# EAGLE design air (EAGLE 8.5.0)
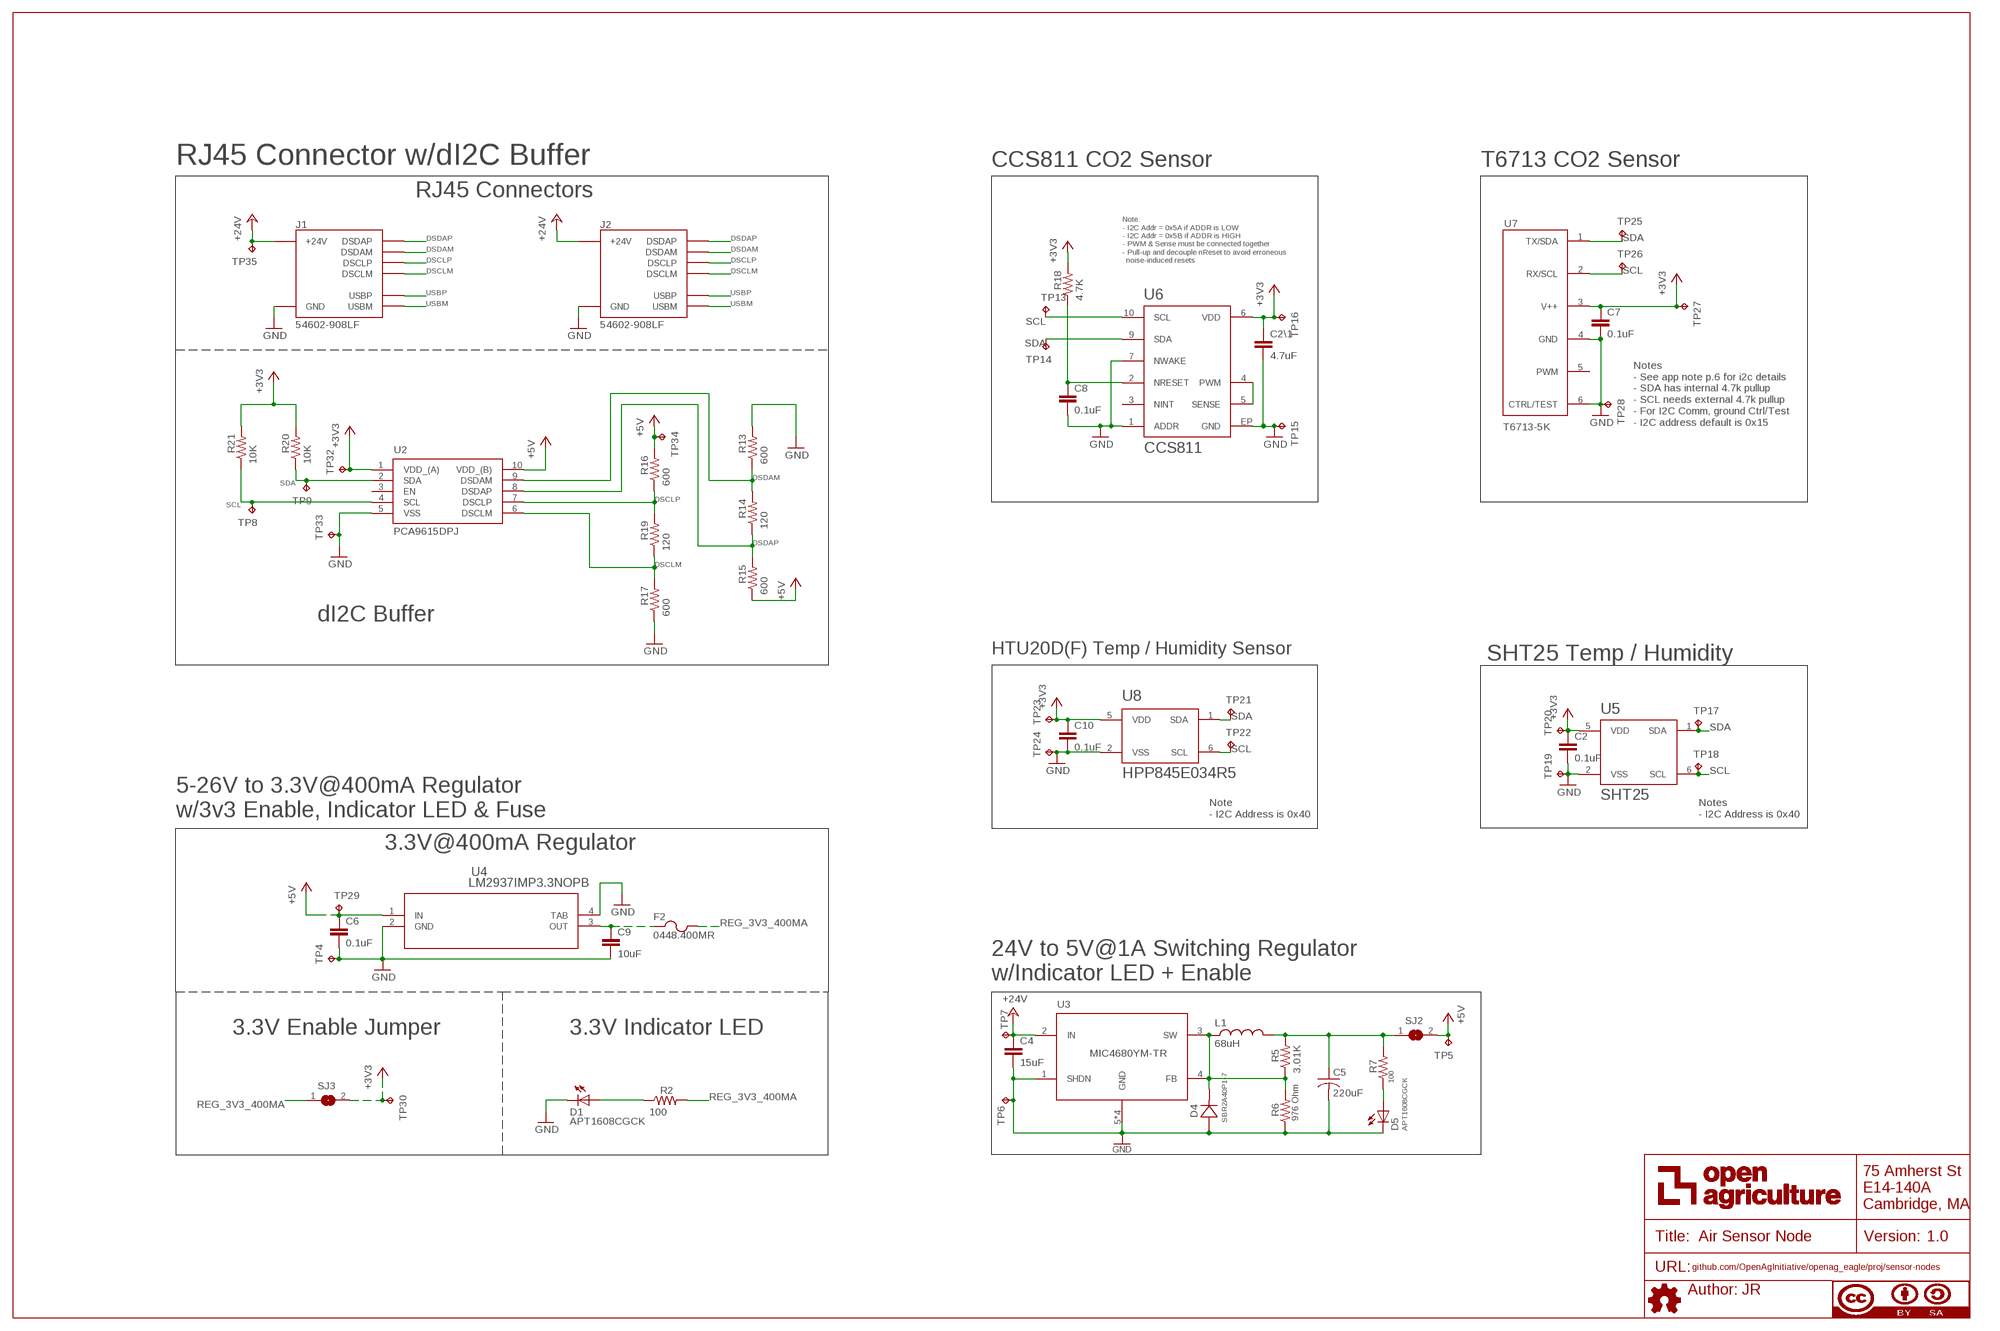
[diagram p0: schematic, sheet 1]

## Parts
C2  0.1uF  0.1UF-C0603C104K5RACTU  [C0603]
C2\1  4.7uF  4.7UF-CL21A475KBQNNNE  [C0805]
C4  15uF  15UF-C2012X5R1V156M125AC  [C0805]
C5  220uF  220UF-TPSY227K010R0100  [CT7343]
C6  0.1uF  0.1UF-C0603C104K5RACTU  [C0603]
C7  0.1uF  0.1UF-C0603C104K5RACTU  [C0603]
C8  0.1uF  0.1UF-C0603C104K5RACTU  [C0603]
C9  10uF  10UF-GMK212BBJ106KG-T  [C0805]
C10  0.1uF  0.1UF-C0603C104K5RACTU  [C0603]
D1  APT1608CGCK  [CHIPLED_0603]
D4  SBR2A40P1-7  [POWERDI123]
D5  APT1608CGCK  [CHIPLED_0603]
F2  0448.400MR  0438.375WR  [0603]
FRAME1  DOCFIELD  [DOCFIELD]
J1  54602-908LF  OPENAG-V1-RJ45PTH  [OPENAG-V1-RJ45]
J2  54602-908LF  OPENAG-V1-RJ45PTH  [OPENAG-V1-RJ45]
L1  68uH  68UH-UP2B-680-R  [UP2B]
R2  100  100OHM-RC0603JR-07100RL  [RC0603N]
R5  3.01K  3.01K-RC0603FR-073K01L  [RC0603N]
R6  976 Ohm  982OHM-RC0603FR-07976RL  [RC0603N]
R7  100  100OHM-RC0603JR-07100RL  [RC0603N]
R13  600  600OHM-RC0603FR-07604RL  [RC0603N]
R14  120  120OHM-RC0603FR-07120RL  [RC0603N]
R15  600  600OHM-RC0603FR-07604RL  [RC0603N]
R16  600  600OHM-RC0603FR-07604RL  [RC0603N]
R17  600  600OHM-RC0603FR-07604RL  [RC0603N]
R18  4.7K  4.7K-RC1206JR-074K7L  [R1206]
R19  120  120OHM-RC0603FR-07120RL  [RC0603N]
R20  10K  10K-ERJ-3EKF1002V  [RC0603N]
R21  10K  10K-ERJ-3EKF1002V  [RC0603N]
SJ2  SOLDERJUMPERREFLOW_NOPASTE  [SOLDERJUMPER_REFLOW_NOPASTE]
SJ3  SOLDERJUMPERREFLOW_NOPASTE  [SOLDERJUMPER_REFLOW_NOPASTE]
TP4  TPTP06R  [TP06R]
TP5  TPTP06R  [TP06R]
TP6  TPTP06R  [TP06R]
TP7  TPTP06R  [TP06R]
TP8  TPTP06R  [TP06R]
TP9  TPTP06R  [TP06R]
TP13  TPTP06R  [TP06R]
TP14  TPTP06R  [TP06R]
TP15  TPTP06R  [TP06R]
TP16  TPTP06R  [TP06R]
TP17  TPTP06R  [TP06R]
TP18  TPTP06R  [TP06R]
TP19  TPTP06R  [TP06R]
TP20  TPTP06R  [TP06R]
TP21  TPTP06R  [TP06R]
TP22  TPTP06R  [TP06R]
TP23  TPTP06R  [TP06R]
TP24  TPTP06R  [TP06R]
TP25  TPTP06R  [TP06R]
TP26  TPTP06R  [TP06R]
TP27  TPTP06R  [TP06R]
TP28  TPTP06R  [TP06R]
TP29  TPTP06R  [TP06R]
TP30  TPTP06R  [TP06R]
TP32  TPTP06R  [TP06R]
TP33  TPTP06R  [TP06R]
TP34  TPTP06R  [TP06R]
TP35  TPTP06R  [TP06R]
U2  PCA9615DPJ  [SOP50P490X110-10N]
U3  MIC4680YM-TR  [SOIC8]
U4  LM2937IMP3.3NOPB  LM2937IMP-3.3/NOPB  [MP04A]
U5  SHT25  [SHT2X]
U6  CCS811  [CCS811]
U7  T6713-5K  [T6713]
U8  HPP845E034R5  [HTU20D(F)]

## Nets
+3V3: C2.1 C2\1.1 C7.1 C10.1 R18.2 R20.2 R21.2 SJ3.2 TP16.TP TP20.TP TP23.TP TP27.TP TP30.TP TP32.TP U2.1(VDD_(A)) U5.5(VDD) U6.6(VDD) U7.3(V++) U8.5(VDD)
+5V: C6.1 R15.1 R16.2 SJ2.2 TP5.TP TP29.TP TP34.TP U2.10(VDD_(B)) U4.1(IN)
+24V: C4.1 J1.24V(6)(+24V) J2.24V(6)(+24V) TP7.TP TP35.TP U3.2(IN)
DSCLM: J1.DSCLM(5)(DSCLM) J2.DSCLM(5)(DSCLM) R17.2 R19.1 U2.6(DSCLM)
DSCLP: J1.DSCLP(4)(DSCLP) J2.DSCLP(4)(DSCLP) R16.1 R19.2 U2.7(DSCLP)
DSDAM: J1.DSDAM(2)(DSDAM) J2.DSDAM(2)(DSDAM) R13.1 R14.2 U2.9(DSDAM)
DSDAP: J1.DSDAP(1)(DSDAP) J2.DSDAP(1)(DSDAP) R14.1 R15.2 U2.8(DSDAP)
GND: C2.2 C2\1.2 C4.2 C5.-(2(-)) C6.2 C7.2 C8.2 C9.2 C10.2 D1.C D4.- D5.C J1.GND(3)(GND) J2.GND(3)(GND) R6.1 R13.2 R17.1 TP4.TP TP6.TP TP15.TP TP19.TP TP24.TP TP28.TP TP33.TP U2.5(VSS) U3.1(SHDN) U3.5(GND) U3.6(GND) U3.7(GND) U3.8(GND) U4.2(GND) U4.4(TAB) U5.2(VSS) U6.1(ADDR) U6.7(NWAKE) U6.EP(GND) U7.4(GND) U7.6(CTRL/TEST) U8.2(VSS)
N$4: D1.A R2.1
N$5: C9.1 F2.1 U4.3(OUT)
N$20: U6.4(PWM) U6.5(SENSE)
N$21: C8.1 R18.1 U6.2(NRESET)
N$31: D4.+ L1.1 R5.1 R6.2 U3.3(SW) U3.4(FB)
N$32: D5.A R7.1
N$33: C5.+(1(+)) L1.2 R5.2 R7.2 SJ2.1
REG_3V3_400MA: F2.2 R2.2 SJ3.1
SCL: R21.1 TP8.TP TP13.TP TP18.TP TP22.TP TP26.TP U2.4(SCL) U5.6(SCL) U6.10(SCL) U7.2(RX/SCL) U8.6(SCL)
SDA: R20.1 TP9.TP TP14.TP TP17.TP TP21.TP TP25.TP U2.2(SDA) U5.1(SDA) U6.9(SDA) U7.1(TX/SDA) U8.1(SDA)
USBM: J1.USBM(8)(USBM) J2.USBM(8)(USBM)
USBP: J1.USBP(7)(USBP) J2.USBP(7)(USBP)
Unconnected: U2.3(EN) U6.3(NINT) U7.5(PWM)

## Notes on the sheet
- RJ45 Connector w/dI2C Buffer | CCS811 CO2 Sensor | T6713 CO2 Sensor
- RJ45 Connectors
- Note:
  - I2C Addr = 0x5A if ADDR is LOW
  - I2C Addr = 0x5B if ADDR is HIGH
  - PWM & Sense must be connected together
  - Pull-up and decouple nReset to avoid erroneous
    noise-induced resets
- Notes
  - See app note p.6 for i2c details
  - SDA has internal 4.7k pullup
  - SCL needs external 4.7k pullup
  - For I2C Comm, ground Ctrl/Test
  - I2C address default is 0x15
- dI2C Buffer
- HTU20D(F) Temp / Humidity Sensor
- SHT25 Temp / Humidity
- 5-26V to 3.3V@400mA Regulator 
  w/3v3 Enable, Indicator LED & Fuse
- Note
  - I2C Address is 0x40
- Notes
  - I2C Address is 0x40
- 3.3V@400mA Regulator
- 24V to 5V@1A Switching Regulator
  w/Indicator LED + Enable
- 3.3V Enable Jumper | 3.3V Indicator LED

## Library data of the parts
C2 C6-C8 C10 = openag-capacitors:0.1UF-C0603C104K5RACTU: Kemet - C0603C104K5RACTU - CAP CER 0.1UF 50V X7R 0603 Description: 0.1µF ±10% 50V Ceramic Capacitor X7R 0603 (1608 Metric) Technical Specifications: Capacitance: 0.1µF Tolerance: ±10% Rated Voltage: 50V Temperature Coefficient: X7R Operating Temperature: -55°C ~ 125°C Package / Case: 0603 (1608 Metric) Datasheet(s): X7R Dielectric, 6.3-250 VDC <https://search.kemet.com/component-edge/download/datasheet/C0603C104K5RACTU.pdf> Vendor(s): Digikey: 399-5089-1-ND <https://www.digikey.com/product-detail/en/kemet/C0603C104K5RACTU/399-5089-1-ND/1465623>; POPULATE: YES; VERIFIED: NO
C2\1 = openag-capacitors:4.7UF-CL21A475KBQNNNE: Samsung - CL21A475KBQNNNE - CAP CER 4.7UF 50V X5R 0805 Description: 4.7µF ±10% 50V Ceramic Capacitor X5R 0805 (2012 Metric) Technical Specifications: Capacitance: 4.7uF Tolerance: ±10% Rated Voltage: 50V Temperature Coefficient: X5R Operating Temperature: -55°C ~ 85°C Package/Case: 0805 (2012 Metric) Datasheet(s): CL21A475KBQNNNE Characteristics <http://www.samsungsem.com/kr/front/downloadcms.do?path=/kr/support/product-search/mlcc/__icsFiles/afieldfile/2014/11/05&fileName=C_CL21A475KBQNNNE.pdf> Vendor(s): Digikey: 1276-1248-1-ND <https://www.digikey.com/product-detail/en/samsung-electro-mechanics/CL21A475KBQNNNE/1276-1248-1-ND/3889334>; POPULATE: YES; VERIFIED: NO
C4 = openag-capacitors:15UF-C2012X5R1V156M125AC: TDK Corporation - C2012X5R1V156M125AC - CAP CER 15UF 35V X5R 0805 Description: 15µF ±20% 35V Ceramic Capacitor X5R 0805 (2012 Metric) Technical Specifications: Capacitance: 15µF Tolerance: ±20% Voltage - Rated: 35V Temperature Coefficient: X5R Operating Temperature: -55°C ~ 85°C Features: Low ESL Applications: General Purpose Mounting Type: Surface Mount, MLCC Package / Case: 0805 (2012 Metric) Size / Dimension: 0.079" L x 0.049" W (2.00mm x 1.25mm) Thickness (Max): 0.057" (1.45mm) Datasheet(s): C Series, General Datasheet <https://product.tdk.com/info/en/catalog/datasheets/mlcc_commercial_general_en.pdf> MLCC Part Number Guide <https://product.tdk.com/en/products/common/pdf/mlcc_partnumber_description.pdf> C Series, Gen Appl & Mid-Voltage Spec <https://product.tdk.com/info/en/catalog/spec/mlccspec_commercial_general_midvoltage_en.pdf> Vendor(s): Digikey: 445-14423-1-ND <https://www.digikey.com/product-detail/en/tdk-corporation/C2012X5R1V156M125AC/445-14423-1-ND/3956089>
C5 = openag-capacitors:220UF-TPSY227K010R0100: AVX Corporation - TPSY227K010R0100 - CAP TANT 220UF 10V 10% 2917 Description: 220µF Molded Tantalum Capacitors 10V 2917 (7343 Metric) 100 mOhm Technical Specifications: Capacitance: 220µF Tolerance: ±10% Voltage - Rated: 10V Type: Molded ESR (Equivalent Series Resistance): 100 mOhm Operating Temperature: -55°C ~ 125°C Mounting Type: Surface Mount Package / Case: 2917 (7343 Metric) Size / Dimension: 0.287" L x 0.169" W (7.30mm x 4.30mm) Height - Seated (Max): 0.079" (2.00mm) Manufacturer Size Code: Y Features: General Purpose Datasheet(s): TPS Series, Low ESR <http://datasheets.avx.com/TPS.pdf> Vendor(s): Digikey: 478-5408-1-ND <https://www.digikey.com/scripts/DkSearch/dksus.dll?Detail&itemSeq=250948888&uq=636531796868737363>
C9 = openag-capacitors:10UF-GMK212BBJ106KG-T: Taiyo Yuden - GMK212BBJ106KG-T - CAP CER 10UF 35V X5R 0805 Description: 10µF ±10% 35V Ceramic Capacitor X5R 0805 (2012 Metric) Technical Specifications: Capacitance: 10µF Tolerance: ±10% Rated Voltage: 35V Temperature Coefficient: X5R Operating Temperature: -55°C ~ 85°C Package / Case: 0805 (2012 Metric) Datasheet(s): GMK212BBJ106KG-T Spec <http://ds.yuden.co.jp/TYCOMPAS/ut/detail.do?productNo=GMK212BBJ106KG-T&fileName=GMK212BBJ106KG-T_SS&mode=specSheetDownload> Vendor(s): Digikey: 587-4893-1-ND <https://www.digikey.com/product-detail/en/taiyo-yuden/GMK212BBJ106KG-T/587-4893-1-ND/6563736>; POPULATE: YES; VERIFIED: NO
D1 D5 = openag-diodes:APT1608CGCK: Kingbright - APT1608CGCK - LED GREEN CLEAR 0603 SMD Description: Green 570nm LED Indication - Discrete 2.1V 0603 (1608 Metric) Technical Specifications: Color: Green Lens Color: Colorless Lens Transparency: Clear Millicandela Rating: 50mcd Lens Style/Size: Rectangle with Flat Top, 1.20mm x 0.80mm Voltage - Forward (Vf) (Typ): 2.1V Current - Test: 20mA Viewing Angle: 120° Mounting Type: Surface Mount Wavelength - Dominant: 570nm Wavelength - Peak: 574nm Package / Case: 0603 (1608 Metric) Supplier Device Package: Chip LED Size / Dimension: 1.60mm L x 0.80mm W Height (Max): 0.75mm Datasheet(s): APT1608CGCK <http://www.kingbrightusa.com/images/catalog/SPEC/APT1608CGCK.pdf> Vendor(s): Digikey: 754-1116-1-ND <https://www.digikey.com/product-detail/en/kingbright/APT1608CGCK/754-1116-1-ND/1747833#>; POPULATE: YES; VERIFIED: NO
D4 = openag-diodes:SBR2A40P1-7: Diodes Incorporated - SBR2A40P1-7 - DIODE SBR 40V 2A POWERDI123 Description: Diode Super Barrier 40V 2A Surface Mount PowerDI™ 123 Technical Specifications: Diode Type: Super Barrier Voltage - DC Reverse (Vr) (Max): 40V Current - Average Rectified (Io): 2A Voltage - Forward (Vf) (Max) @ If: 500mV @ 2A Speed: Standard Recovery >500ns, > 200mA (Io) Current - Reverse Leakage @ Vr: 100µA @ 40V Mounting Type: Surface Mount Package / Case: POWERDI®123 Supplier Device Package: PowerDI™ 123 Operating Temperature - Junction: -65°C ~ 150°C Base Part Number: SBR2A40 Datasheet(s): SBR2A40P1 <https://www.diodes.com/assets/Datasheets/SBR2A40P1.pdf> Vendor(s): Digikey: SBR2A40P1DITR-ND <https://www.digikey.com/product-detail/en/diodes-incorporated/SBR2A40P1-7/SBR2A40P1DITR-ND/1681825>
F2 = openag-fuses:0438.375WR: Littelfuse Inc. - 0448.400MR - FUSE BOARD MNT 400MA 125VAC/VDC Description: FUSE BOARD MNT 400MA 125VAC/VDC Technical Specifications: Fuse Type: Board Mount (Cartridge Style Excluded) Current Rating: 400mA Voltage Rating - AC: 125V Voltage Rating - DC: 125V Response Time: Fast Package / Case: 2-SMD, Square End Block Mounting Type: Surface Mount Breaking Capacity @ Rated Voltage: 50A Melting I²t: 0.0416 Approvals: CSA, UL Operating Temperature: -55°C ~ 125°C Size / Dimension: 0.240" L x 0.106" W x 0.106" H (6.10mm x 2.69mm x 2.69mm) DC Cold Resistance: 0.4895 Ohms Datasheet(s): 448 Series Datasheet <http://www.littelfuse.com/~/media/electronics/datasheets/fuses/littelfuse_fuse_448_datasheet.pdf.pdf> Vendor(s): Digikey: F5573CT-ND <https://www.digikey.com/product-detail/en/littelfuse-inc/0448.400MR/F5573CT-ND/3306934>; POPULATE: YES; VERIFIED: YES
FRAME1 = openag-frames:DOCFIELD: DOCUMENT FIELD; AUTHOR: JR; TITLE: Air Sensor Node; URL: github.com/OpenAgInitiative/openag_eagle/proj/sensor-nodes; VER: 1.0
J1 J2 = openag_connector:OPENAG-V1-RJ45: Amphenol FCI - 54602-908LF - CONN MOD JACK 8P8C R/A UNSHLD Description: Jack Modular Connector 8p8c (RJ45, Ethernet) 90� Angle (Right) Unshielded Cat3 Technical Specifications: Connector Type: Jack Number of Positions/Contacts: 8p8c (RJ45, Ethernet) Number of Ports: 1 Number of Rows: 1 Mounting Type: Through Hole Orientation: 90� Angle (Right) Termination: Solder Shielding: Unshielded Ratings: Cat3 Features: Board Lock LED Color: Does Not Contain LED Tab Direction: Down Contact Material: Copper Alloy Contact Finish: Gold Contact Finish Thickness: 15�in (0.38�m) Housing Material: Polyester, Glass Filled Operating Temperature: -40�C ~ 70�C Datasheet(s): 54601-x04(zzz)WPLF Drawing <http://cdn.amphenol-icc.com/media/wysiwyg/files/drawing/c-bmj-0102.pdf> Vendor(s): Digikey: 609-1046-ND <https://www.digikey.com/product-detail/en/amphenol-fci/54602-908LF/609-1046-ND/1001360>; POPULATE: YES; VERIFIED: NO
L1 = openag-inductors:68UH-UP2B-680-R: Eaton - UP2B-680-R - FIXED IND 68UH 1.5A 178.7 MOHM Description: 68µH Unshielded Wirewound Inductor 1.5A 178.7 mOhm Max Nonstandard Technical Specifications: Type: Wirewound Material - Core: Ferrite Inductance: 68µH Tolerance: ±20% Current Rating: 1.5A Current - Saturation: 1.2A Shielding: Unshielded DC Resistance (DCR): 178.7 mOhm Max Operating Temperature: -40°C ~ 85°C Frequency - Test: 100kHz Mounting Type: Surface Mount Package / Case: Nonstandard Size / Dimension: 0.550" L x 0.410" W (13.97mm x 10.41mm) Height - Seated (Max): 0.236" (6.00mm) Datasheet(s): UNI-PAC (-R) <http://www.cooperindustries.com/content/dam/public/bussmann/Electronics/Resources/product-datasheets/BUS_Elx_PM_4308_UNI_PAC_Power_Inductors.pdf> Vendor(s): Digikey: 513-1083-1-ND <https://www.digikey.com/scripts/DkSearch/dksus.dll?Detail&itemSeq=250945518&uq=636531821133403587>
R2 R7 = openag-resistors:100OHM-RC0603JR-07100RL: Yageo - RC0603JR-07100RL - RES SMD 100 OHM 5% 1/10W 0603 Description: 100 Ohms ±5% 0.1W, 1/10W Chip Resistor 0603 (1608 Metric) Moisture Resistant Thick Film Technical Specifications: Resistance: 100 Ohms Tolerance: ±5% Power (Watts): 0.1W, 1/10W Composition: Thick Film Features: Moisture Resistant Temperature Coefficient: ±100ppm/°C Operating Temperature: -55°C ~ 155°C Package / Case: 0603 (1608 Metric) Supplier Device Package: 0603 Size / Dimension: 0.063" L x 0.032" W (1.60mm x 0.80mm) Height - Seated (Max): 0.022" (0.55mm) Number of Terminations: 2 Datasheet(s): Thick Film Chip Resistor Intro <http://www.yageo.com.tw/exep/pages/download/literatures/PYu-R_INT-thick_7.pdf> Chip Resistor Marking <http://www.yageo.com/exep/pages/download/literatures/PYu-R_Marking_2.pdf> RC Series, L Datasheet <http://www.yageo.com/documents/recent/PYu-RC_Group_51_RoHS_L_8.pdf> Vendor(s): Digikey: 311-100GRCT-ND <https://www.digikey.com/product-detail/en/yageo/RC0603JR-07100RL/311-100GRCT-ND/729644>; POPULATE: YES; VERIFIED: NO
R5 = openag-resistors:3.01K-RC0603FR-073K01L: Yageo - RC0603FR-073K01L - RES SMD 3.01K OHM 1% 1/10W 0603 Description: 3.01 kOhms ±1% 0.1W, 1/10W Chip Resistor 0603 (1608 Metric) Moisture Resistant Thick Film Technical Specifications: Resistance: 3.01 kOhms Tolerance: ±1% Power (Watts): 0.1W, 1/10W Composition: Thick Film Features: Moisture Resistant Temperature Coefficient: ±100ppm/°C Operating Temperature: -55°C ~ 155°C Package / Case: 0603 (1608 Metric) Supplier Device Package: 0603 Size / Dimension: 0.063" L x 0.032" W (1.60mm x 0.80mm) Height - Seated (Max): 0.022" (0.55mm) Number of Terminations: 2 Datasheet(s): Chip Resistor Marking <http://www.yageo.com/exep/pages/download/literatures/PYu-R_Marking_2.pdf> RC Series, L Datasheet <http://www.yageo.com/documents/recent/PYu-RC_Group_51_RoHS_L_8.pdf> Vendor(s): Digikey: 311-3.01KHRCT-ND <https://www.digikey.com/scripts/DkSearch/dksus.dll?Detail&itemSeq=250949714&uq=636531832410541188>
R6 = openag-resistors:982OHM-RC0603FR-07976RL: Yageo - RC0603FR-07976RL - RES SMD 976 OHM 1% 1/10W 0603 Description: 976 Ohms ±1% 0.1W, 1/10W Chip Resistor 0603 (1608 Metric) Moisture Resistant Thick Film Technical Specifications: Resistance: 976 Ohms Tolerance: ±1% Power (Watts): 0.1W, 1/10W Composition: Thick Film Features: Moisture Resistant Temperature Coefficient: ±100ppm/°C Operating Temperature: -55°C ~ 155°C Package / Case: 0603 (1608 Metric) Supplier Device Package: 0603 Size / Dimension: 0.063" L x 0.032" W (1.60mm x 0.80mm) Height - Seated (Max): 0.022" (0.55mm) Number of Terminations: 2 Datasheet(s): Chip Resistor Marking <http://www.yageo.com/exep/pages/download/literatures/PYu-R_Marking_2.pdf> RC Series, L Datasheet <http://www.yageo.com/documents/recent/PYu-RC_Group_51_RoHS_L_8.pdf> Vendor(s): Digikey: 311-976HRCT-ND <https://www.digikey.com/scripts/DkSearch/dksus.dll?Detail&itemSeq=250949870&uq=636531835229553061>
R13 R15-R17 = openag-resistors:600OHM-RC0603FR-07604RL: Yageo - RC0603FR-07604RL - RES SMD 604 OHM 1% 1/10W 0603 Description: 604 Ohms ±1% 0.1W, 1/10W Chip Resistor 0603 (1608 Metric) Moisture Resistant Thick Film Technical Specifications: Resistance: 604 Ohms Tolerance: ±1% Power (Watts): 0.1W, 1/10W Composition: Thick Film Features: Moisture Resistant Temperature Coefficient: ±100ppm/°C Operating Temperature: -55°C ~ 155°C Package / Case: 0603 (1608 Metric) Supplier Device Package: 0603 Size / Dimension: 0.063" L x 0.032" W (1.60mm x 0.80mm) Height - Seated (Max): 0.022" (0.55mm) Number of Terminations: 2 Datasheet(s): RC Series, L Datasheet <http://www.yageo.com/documents/recent/PYu-RC_Group_51_RoHS_L_8.pdf> Chip Resistor Marking <http://www.yageo.com/exep/pages/download/literatures/PYu-R_Marking_2.pdf> Vendor(s): Digikey: 311-604HRCT-ND <https://www.digikey.com/product-detail/en/yageo/RC0603FR-07604RL/311-604HRCT-ND/730276>
R14 R19 = openag-resistors:120OHM-RC0603FR-07120RL: Yageo - RC0603FR-07120RL - RES SMD 120 OHM 1% 1/10W 0603 Description: 120 Ohms ±1% 0.1W, 1/10W Chip Resistor 0603 (1608 Metric) Moisture Resistant Thick Film Technical Specifications: Resistance: 120 Ohms Tolerance: ±1% Power (Watts): 0.1W, 1/10W Composition: Thick Film Features: Moisture Resistant Temperature Coefficient: ±100ppm/°C Operating Temperature: -55°C ~ 155°C Package / Case: 0603 (1608 Metric) Supplier Device Package: 0603 Size / Dimension: 0.063" L x 0.032" W (1.60mm x 0.80mm) Height - Seated (Max): 0.022" (0.55mm) Number of Terminations: 2 Datasheet(s): RC Series, L Datasheet <http://www.yageo.com/documents/recent/PYu-RC_Group_51_RoHS_L_8.pdf> Chip Resistor Marking <http://www.yageo.com/exep/pages/download/literatures/PYu-R_Marking_2.pdf> Vendor(s): Digikey: 311-120HRCT-ND <https://www.digikey.com/product-detail/en/yageo/RC0603FR-07120RL/311-120HRCT-ND/729867>
R18 = openag-resistors:4.7K-RC1206JR-074K7L: Yageo - RC1206JR-074K7L - RES SMD 4.7K OHM 5% 1/4W 1206 Description: 4.7 kOhms ±5% 0.25W, 1/4W Chip Resistor 1206 (3216 Metric) Moisture Resistant Thick Film Technical Specifications: Resistance: 4.7 kOhms Tolerance: ±5% Power (Watts): 0.25W, 1/4W Composition: Thick Film Features: Moisture Resistant Temperature Coefficient: ±100ppm/°C Operating Temperature: -55°C ~ 155°C Package / Case: 1206 (3216 Metric) Supplier Device Package: 1206 Size / Dimension: 0.122" L x 0.063" W (3.10mm x 1.60mm) Height - Seated (Max): 0.026" (0.65mm) Number of Terminations: 2 Datasheet(s): Thick Film Chip Resistor Intro <http://www.yageo.com.tw/exep/pages/download/literatures/PYu-R_INT-thick_7.pdf> Chip Resistor Marking <http://www.yageo.com/exep/pages/download/literatures/PYu-R_Marking_2.pdf> RC Series, L Datasheet <http://www.yageo.com/documents/recent/PYu-RC_Group_51_RoHS_L_8.pdf> Vendor(s): Digikey: 311-4.7KERCT-ND <https://www.digikey.com/product-detail/en/yageo/RC1206JR-074K7L/311-4.7KERCT-ND/732242>; POPULATE: YES; VERIFIED: NO
R20 R21 = openag-resistors:10K-ERJ-3EKF1002V: Panasonic - ERJ-3EKF1002V - RES SMD 10K OHM 1% 1/10W 0603 Description: 10 kOhms ±1% 0.1W, 1/10W Chip Resistor 0603 (1608 Metric) Automotive AEC-Q200 Thick Film Technical Specifications: Resistance: 10kOhms Tolerance: ±1% Power: 0.1W, 1/10W Operating Temperature: -55°C ~ 155°C Package/Case: 0603 (1608 Metric) Datasheet(s): ERJ-3EKF1002V View All Specifications <https://industrial.panasonic.com/ww/products/resistors/chip-resistors/general-purpose-chip-resistors/precision-thick-film-chip-resistors/ERJ3EKF1002V> Vendor(s): Digikey: P10.0KHCT-ND <https://www.digikey.com/product-detail/en/panasonic-electronic-components/ERJ-3EKF1002V/P10.0KHCT-ND/198102>; POPULATE: YES; VERIFIED: NO
SJ2 SJ3 = openag-connectors:SOLDERJUMPER: SMD Solder JUMPER Solder the two pads together to create a connection, or remove the solder to break it. REFLOW - Use this footprint for solder paste and reflow ovens. WAVE - Use this footprint for hand-soldering (larger pads). CLOSED - Has a trace between the two pads to ensure it is closed by default. The trace needs to be cut to disable the jumper, and can be closed again by creating a solder bridge between the two pads.; POPULATE: YES; VERIFIED: NO
TP4-TP9 TP13-TP30 TP32-TP35 = openag-testpads:TP: Test pad
U2 = openag-buffers:PCA9615DPJ: NXP USA Inc. - PCA9615DPJ - IC REDRIVER I2C 2CH 10TSSOP Description: Buffer, ReDriver 2 Channel 400kHz 10-TSSOP Technical Specifications: Type: Buffer, ReDriver Applications: I²C Input: 2-Wire Bus Output: 2-Wire Bus Data Rate (Max): 400kHz Number of Channels: 2 Capacitance - Input: 7pF Voltage - Supply: 2.3 V ~ 5.5 V Current - Supply: 16µA Operating Temperature: -40°C ~ 85°C Package / Case: 10-TFSOP, 10-MSOP (0.118", 3.00mm Width) Supplier Device Package: 10-TSSOP Base Part Number: PCA9615 Datasheet(s): PCA9615DP <http://www.nxp.com/documents/data_sheet/PCA9615.pdf> Vendor(s): Digikey: 568-11484-1-ND <https://www.digikey.com/product-detail/en/nxp-usa-inc/PCA9615DPJ/568-11484-1-ND/4864508>
U3 = openag-regulators:MIC4680YM-TR: Microchip Technology - MIC4680YM-TR - IC REG BUCK BOOST ADJ 1.3A 8SOIC Description: Buck, Buck-Boost Switching Regulator IC Positive Adjustable 1.23V 1 Output 1.3A 8-SOIC (0.154", 3.90mm Width) Technical Specifications: Function: Step-Down, Step-Up/Step-Down Output Configuration: Positive Topology: Buck, Buck-Boost Output Type: Adjustable Number of Outputs: 1 Voltage - Input (Min): 4V Voltage - Input (Max): 34V Voltage - Output (Min/Fixed): 1.23V Voltage - Output (Max): 32.98V Current - Output: 1.3A Frequency - Switching: 200kHz Synchronous Rectifier: No Operating Temperature: -40°C ~ 125°C (TJ) Mounting Type: Surface Mount Package / Case: 8-SOIC (0.154", 3.90mm Width) Supplier Device Package: 8-SOIC Base Part Number: MIC4680 Datasheet(s): MIC4680 <http://www.microchip.com/mymicrochip/filehandler.aspx?ddocname=en579250> Vendor(s): Digikey: 576-1222-1-ND <https://www.digikey.com/scripts/DkSearch/dksus.dll?Detail&itemSeq=250950999&uq=636531791983475304>
U4 = openag-regulators:LM2937IMP-3.3/NOPB: Texas Instruments - LM2937IMP-3.3/NOPB - IC REG LIN 3.3V 400MA SOT223-4 Description: Linear Voltage Regulator IC Positive Fixed 1 Output 3.3V 400mA SOT-223-4 Technical Specifications: Output Configuration: Positive Output Type: Fixed Number of Regulators: 1 Voltage - Input (Max): 26V Voltage - Output (Min/Fixed): 3.3V Voltage Dropout (Max): 1V @ 50mA Current - Output: 400mA Current - Quiescent (Iq): 2mA Current - Supply (Max): 1.25A Protection Features: Over Temperature, Reverse Polarity, Short Circuit Operating Temperature: -40°C ~ 85°C Mounting Type: Surface Mount Package / Case: TO-261-4, TO-261AA Supplier Device Package: SOT-223-4 Base Part Number: LM2937 Datasheet(s): LM2937-2.5, LM2937-3.3 Datasheet <http://www.ti.com/lit/ds/symlink/lm2937-2.5.pdf> Vendor(s): Digikey: LM2937IMP-3.3/NOPBCT-ND <https://www.digikey.com/product-detail/en/texas-instruments/LM2937IMP-3.3-NOPB/LM2937IMP-3.3-NOPBCT-ND/270742#>; POPULATE: YES; VERIFIED: NO
U5 = openag-sensors:SHT25: Sensirion AG - SHT25 - SENSOR HUMI/TEMP 3V I2C 1.8% SMD Description: Humidity Temperature Sensor 0 ~ 100% RH I²C ±1.8% RH 8s Surface Mount Technical Specifications: Sensor Type: Humidity, Temperature Humidity Range: 0 ~ 100% RH Output Type: I²C Output: 12b Accuracy: ±1.8% RH Response Time: 8s Voltage - Supply: 2.1 V ~ 3.6 V Mounting Type: Surface Mount Operating Temperature: -40°C ~ 125°C Datasheet(s): SHTxx Testing Guide <https://www.sensirion.com/fileadmin/user_upload/customers/sensirion/Dokumente/2_Humidity_Sensors/Sensirion_Humidity_Sensors_Testing_Guide_V1.2.pdf> SHTxx Handling Instructions <https://www.sensirion.com/fileadmin/user_upload/customers/sensirion/Dokumente/2_Humidity_Sensors/Sensirion_Humidity_Sensors_Handling_Instructions_V4.pdf> Sensor Specification Statement <https://www.sensirion.com/fileadmin/user_upload/customers/sensirion/Dokumente/2_Humidity_Sensors/Sensirion_Humidity_Sensors_Specification_Statement_V1.pdf> SHTxx, STSxx Assembly SMD Pkgs <https://www.sensirion.com/fileadmin/user_upload/customers/sensirion/Dokumente/2_Humidity_Sensors/Sensirion_Humidity_Sensors_Handling_of_SMD_Packages_V1.pdf> SHT25 Datasheet <https://www.sensirion.com/fileadmin/user_upload/customers/sensirion/Dokumente/2_Humidity_Sensors/Sensirion_Humidity_Sensors_SHT25_Datasheet_V3.pdf> Vendor(s): Digikey: 1649-1008-1-ND <https://www.digikey.com/product-detail/en/sensirion-ag/SHT25/1649-1008-1-ND/5872290>; POPULATE: YES; VERIFIED: NO
U6 = openag-sensors:CCS811: ams - CCS811 - LOW POWER DIGITAL SENSOR FOR IND Description: Air Quality Sensor I²C Technical Specifications: Type: Air Quality Output: I²C Operating Temperature: -5°C ~ 50°C Voltage - Supply: 1.8 V ~ 3.6 V Current - Supply: 26mA Datasheet(s): CCS811 Datasheet <http://ams.com/eng/content/download/951091/2269479/471718> CCS811 Factsheet <http://ams.com/eng/content/view/download/490399> Vendor(s): Digikey: CCS811CT-ND <https://www.digikey.com/product-detail/en/ams/CCS811/CCS811CT-ND/6569300>; POPULATE: YES; VERIFIED: NO
U7 = openag-sensors:T6713-5K: Amphenol Advanced Sensors - T6713-5K - CO2 MODULE 5000PPM DIFFUSION Description: CO2 Sensor I²C Technical Specifications: Type: CO2 Accuracy: ±2% Output: I²C Operating Temperature: 14 ~ 140°F (-10 ~ 60°C) Voltage - Supply: 4.5 V ~ 5.5 V Current - Supply: 200mA Datasheet(s): T6713 Series Datasheet <http://www.amphenol-sensors.com/en/component/edocman/297-telaire-t6713-series-datasheet/download?Itemid=591> Telaire CO2 Module Selection Guide <http://www.amphenol-sensors.com/en/component/edocman/488-telaire-co2-module-selection-guide-single-or-dual-channel/download?Itemid=591> T67xx Appl Note <http://www.amphenol-sensors.com/en/component/edocman/332-telaire-6700-series-application-note/download?Itemid=591> Vendor(s): Digikey: 235-1374-ND <https://www.digikey.com/products/en?keywords=235-1374>; POPULATE: YES; VERIFIED: NO
U8 = openag-sensors:HPP845E034R5: TE Connectivity Measurement Specialties - HPP845E034R5 - SENSOR HUMID/TEMP 3V I2C 3% SMD Description: Humidity Temperature Sensor 0 ~ 100% RH I²C ±5% RH 5s Surface Mount Technical Specifications: Sensor Type: Humidity, Temperature Humidity Range: 0 ~ 100% RH Output Type: I²C Output: 12b Accuracy: ±5% RH Response Time: 5s Voltage - Supply: 1.5 V ~ 3.6 V Mounting Type: Surface Mount Operating Temperature: -40°C ~ 125°C Datasheet(s): HTU20D(F) Series (HPP845E034Rx) Datasheet <http://www.te.com/commerce/DocumentDelivery/DDEController?Action=srchrtrv&DocNm=HPC202_5&DocType=Data+Sheet&DocLang=English> Vendor(s): Digikey: 223-1592-1-ND <https://www.digikey.com/product-detail/en/te-connectivity-measurement-specialties/HPP845E034R5/223-1592-1-ND/5416096>; POPULATE: YES; VERIFIED: NO

## Board
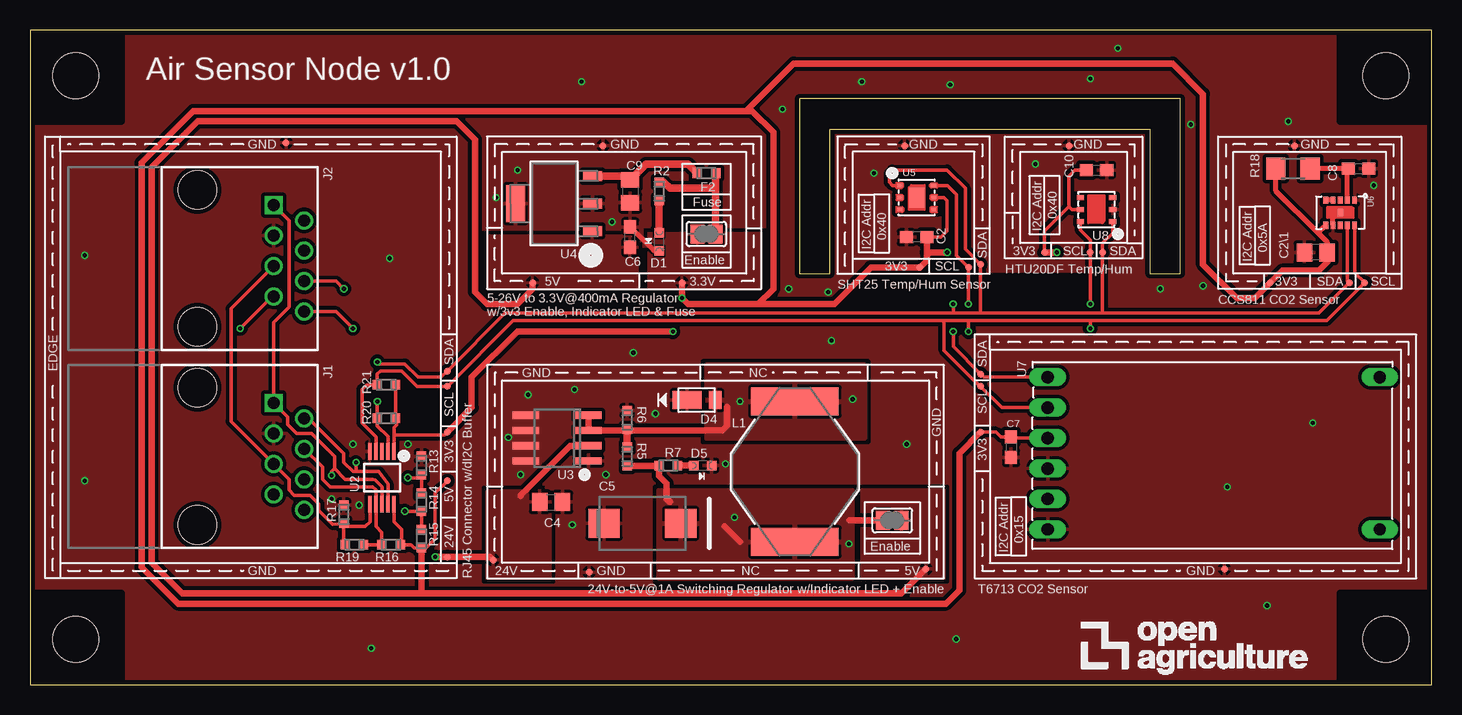
[diagram p1: board, top side]
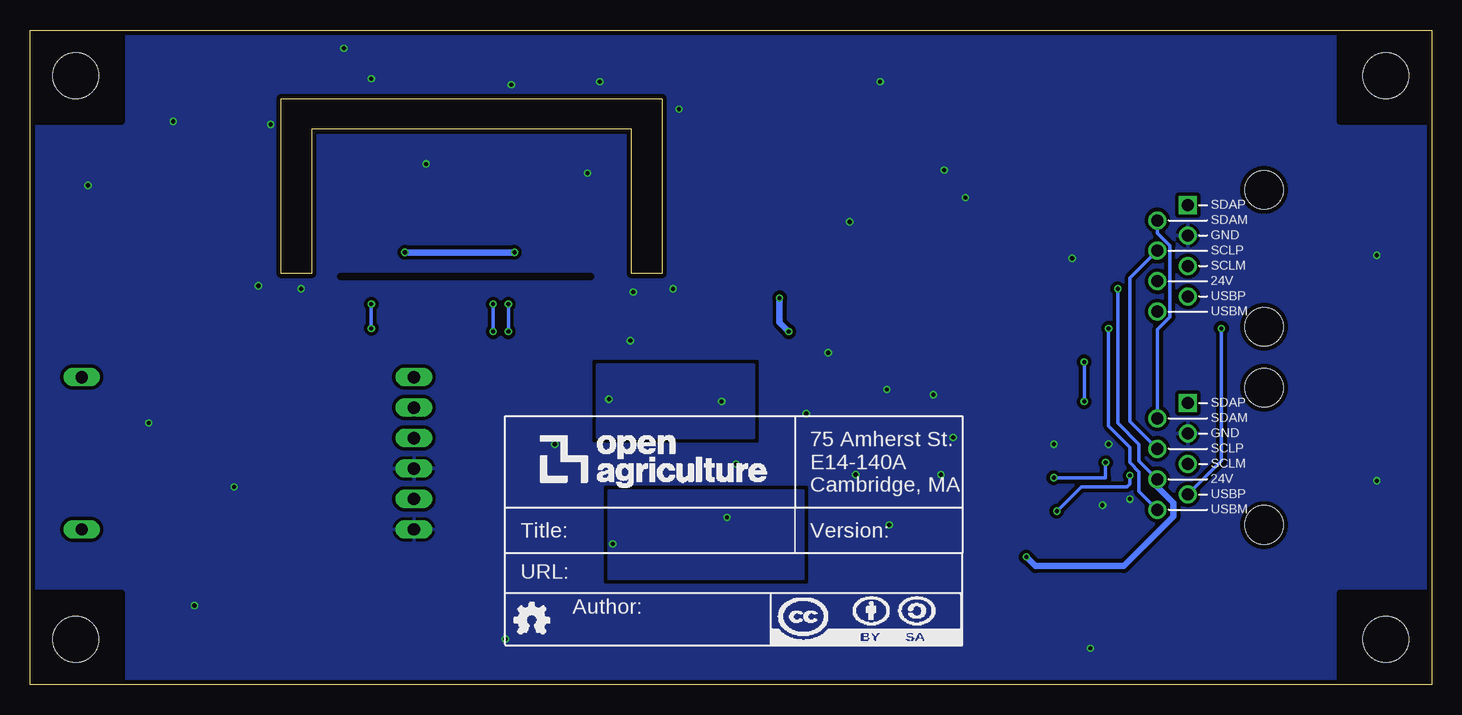
[diagram p2: board, bottom side, seen from below]

Size 116.84 x 54.61 mm. Coordinates in mm from the lower left corner, seen from the top.
Outline: 66.67,34.29 66.67,46.35 93.34,46.35 93.34,34.29 95.89,34.29 95.89,48.9 64.14,48.9 64.14,34.29 66.67,34.29
Outline: 0,0 116.84,0 116.84,54.61 0,54.61 0,0
Copper layers (1*16): Top 0.035559375mm / dielectric 1.6mm / Bottom 0.035559375mm
Design rules "oshpark-2layer-mask": minimum track width 6mil, minimum drill 10mil, track to track 6mil, track to pad 6mil, pad to pad 6mil, via to via 6mil, smd to smd 6mil, copper to edge 15mil, drill to drill 6mil, minimum pad ring 5mil, minimum via ring 5mil, stop-mask expansion 2.5mil, vias tented up to drill 20mil, thermal gap 10mil
tRestrict: 2 lines
bRestrict: 1 lines

### Footprints (pad centres in the part's own frame; a part is rotated, then mirrored left to right if it is on the bottom)
C0603 = smd 1.1 x 1: 1 -0.85,0; 2 0.85,0
C0805 = smd 1.3 x 1.5: 1 -0.95,0; 2 0.95,0
CT7343 = smd 2.6 x 2.4: + -3.2,0; - 3.2,0
CHIPLED_0603 = smd 0.8 x 0.8: A 0,-0.75; C 0,0.75
POWERDI123 = smd 1.05 x 1.5: + -1.3,0 | smd 2.4 x 1.5: - 1.05,0
0603 = smd 0.756 x 0.8: 1 -0.778,0; 2 0.778,0
OPENAG-V1-RJ45 = drill 1: 24V(6) 1.905,8.89; DSCLM(5) 0.635,6.35; DSCLP(4) -0.635,8.89; DSDAM(2) -3.175,8.89; GND(3) -1.905,6.35; USBM(8) 4.445,8.89; USBP(7) 3.175,6.35 | drill 1 square: DSDAP(1) -4.445,6.35 | hole 3.2: -5.715,0; 5.715,0
UP2B = smd 2.311 x 7.29: 1 -5.855,0; 2 5.855,0
RC0603N = smd 0.756 x 0.8: 1 -0.778,0; 2 0.778,0
R1206 = smd 1.6 x 1.803: 1 -1.422,0; 2 1.422,0
SOLDERJUMPER_REFLOW_NOPASTE = smd 1.168 x 1.6: 1 -0.762,0; 2 0.762,0
TP06R = smd 0.6 x 0.6: TP 0,0
SOP50P490X110-10N = smd 1.4 x 0.3: 1 -2.2,1; 2 -2.2,0.5; 3 -2.2,0; 4 -2.2,-0.5; 5 -2.2,-1; 6 2.2,-1; 7 2.2,-0.5; 8 2.2,0; 9 2.2,0.5; 10 2.2,1
SOIC8 = smd 0.6 x 2.2: 1 -1.905,-2.6; 2 -0.635,-2.6; 3 0.635,-2.6; 4 1.905,-2.6; 5 1.905,2.6; 6 0.635,2.6; 7 -0.635,2.6; 8 -1.905,2.6
MP04A = smd 1.6 x 0.838: 1 -3.2,2.3; 2 -3.2,0; 3 -3.2,-2.3 | smd 1.6 x 3.099: 4 3.2,0
SHT2X = smd 0.3 x 0.4: 1 -1,-1.4; 2 0,-1.4; 3 1,-1.4; 4 1,1.4; 5 0,1.4; 6 -1,1.4 | smd 1.651 x 1.27: 7 0,0
CCS811 = smd 0.6 x 0.4: 1 -1.05,1.2; 2 -1.05,0.6; 3 -1.05,0; 4 -1.05,-0.6; 5 -1.05,-1.2; 6 1.05,-1.2; 7 1.05,-0.6; 8 1.05,0; 9 1.05,0.6; 10 1.05,1.2; EP 0,0
T6713 = drill 1.016 long: 1 1.27,-1.27; 2 1.27,-3.81; 3 1.27,-6.35; 4 1.27,-8.89; 5 1.27,-11.43; 6 1.27,-13.97; 7 28.96,-13.97; 8 28.96,-1.27
HTU20D(F) = smd 0.4 x 0.6: 1 -1,-1.35; 2 0,-1.35; 3 1,-1.35; 4 1,1.35; 5 0,1.35; 6 -1,1.35
OPENAG-CORNER-MOUNTING-HOLE = hole 3.81: 0,0

### Placement (x,y rotation side)
C2  73.91,37.34 180 top
C2\1  107.19,36.07 180 top
C4  43.43,15.24 0 top
C5  51.05,13.46 180 top
C6  50.04,37.34 90 top
C7  81.79,19.81 270 top
C8  110.74,43.05 0 top
C9  50.04,41.15 270 top
C10  88.9,42.93 0 top
D1  APT1608  [CHIPLED_0603]  52.45,36.96 180 top
D4  55.82,23.75 180 top
D5  APT1608  [CHIPLED_0603]  56.07,18.29 270 top
F2  56.39,42.67 0 top
FRAME1  77.22,3.3 0 bottom
J1  13.97,19.05 270 top
J2  13.97,35.56 270 top
L1  63.75,17.78 270 top
R2  52.45,41.15 90 top
R5  49.78,19.05 270 top
R6  49.78,22.1 270 top
R7  53.21,18.29 180 top
R13  32.64,18.29 90 top
R14  32.64,15.24 90 top
R15  32.64,12.19 90 top
R16  30.1,11.68 0 top
R17  26.16,14.22 270 top
R18  105.28,43.05 180 top
R19  27.05,11.68 0 top
R20  29.72,22.23 0 top
R21  29.72,25.02 0 top
SJ2  71.88,13.72 0 top
SJ3  56.39,37.59 180 top
TP4  47.75,44.96 180 top
TP5  74.68,9.65 180 top
TP6  46.61,9.4 180 top
TP7  38.61,10.41 180 top
TP8  34.8,24.89 0 top
TP9  34.8,26.16 0 top
TP13  111.25,33.53 90 top
TP14  109.98,33.53 90 top
TP15  105.41,44.96 90 top
TP16  103.38,33.53 90 top
TP17  79.25,35.05 90 top
TP18  78.23,34.8 90 top
TP19  72.9,44.96 90 top
TP20  74.17,34.8 90 top
TP21  89.41,36.07 90 top
TP22  88.39,36.07 90 top
TP23  84.58,36.07 90 top
TP24  86.61,44.96 90 top
TP25  79.25,25.91 0 top
TP26  79.25,24.89 0 top
TP27  79.25,21.08 0 top
TP28  99.57,9.65 0 top
TP29  41.91,33.53 180 top
TP30  54.36,33.53 180 top
TP32  34.8,21.08 0 top
TP33  21.34,45.21 0 top
TP34  34.8,17.02 0 top
TP35  34.8,10.67 0 top
U2  29.34,17.27 270 top
U3  43.94,20.57 90 top
U4  43.69,40.13 180 top
U5  73.91,40.64 270 top
U6  109.22,39.37 270 top
U7  83.57,26.92 0 top
U8  88.9,39.62 90 top
U$1  [OPENAG-CORNER-MOUNTING-HOLE]  3.81,3.81 0 top
U$2  [OPENAG-CORNER-MOUNTING-HOLE]  3.81,50.8 270 top
U$3  [OPENAG-CORNER-MOUNTING-HOLE]  113.03,3.81 90 top
U$4  [OPENAG-CORNER-MOUNTING-HOLE]  113.03,50.8 180 top
U$5  [OPENAG-LOGO-750-MIL]  87.63,1.27 0 top

### Tracks (layer width: path | path; a pad name or v marks a point on that pad's centre or on a via)
+3V3  (via drill 0.35)
  Top 0.305: C10.1 87.12,42.93 86.61,42.42 86.61,39.88 | U8.5 86.87,39.62 86.61,39.88 | C2.1 75.95,37.34 76.45,37.85 76.45,40.39 76.2,40.64 U5.5 | U7.3 81.88,20.57 C7.1 80.94,20.66 80.52,21.08 TP27.TP | U2.1 30.34,20.83 | 30.34,20.83 30.34,21.45 30.57,21.68 30.57,22.15 R20.2 R21.2 | TP32.TP 34.54,20.83 30.34,20.83 | TP23.TP 84.58,37.85 86.61,39.88
  Top 0.356: 107.75,38.05 U6.6
  Top 0.406: 107.38,37.68 107.75,38.05 107.91,38.21 | 107.38,37.68 103.86,41.19 R18.2 | 107.38,37.68 108.14,36.91 C2\1.1
  Top 0.559: TP27.TP 77.47,19.3 77.47,7.87 76.35,6.76 12.34,6.76 9.3,9.8 9.3,43.54 13.61,47.85 59.69,47.85 | 59.69,47.85 60.2,47.85 61.98,46.08 61.98,33.02 60.71,31.75 | TP32.TP 36.83,23.11 36.83,25.65 40.64,29.46 v53.59,29.46 | TP30.TP v54.36,32.26 54.86,31.75 60.71,31.75 | C2.1 74.76,36.07 | 74.76,36.07 74.76,35.39 TP20.TP 70.1,34.8 67.06,31.75 60.71,31.75 | C2\1.1 108.14,35.24 107.44,34.54 104.39,34.54 TP16.TP 102.11,32.26 100.58,32.26 97.79,35.05 97.79,49.28 95.25,51.82 63.65,51.82 59.69,47.85 | 74.76,36.07 v76.45,36.07 | v85.6,36.07 TP23.TP
  Bottom 0.559: v54.36,32.26 54.36,30.23 v53.59,29.46 | v76.45,36.07 v85.6,36.07
  pour Top: 51.56,33.02 51.56,37.72 60.96,37.72 60.96,33.02
+5V
  Top 0.305: U2.10 30.34,13.61 30.99,12.95 30.99,11.72 R16.2 31.75,11.68 32.02,11.41 R15.1 33,11.41 33.78,12.19 33.78,16 TP34.TP
  Top 0.559: 32.77,7.62 12.7,7.62 10.16,10.16 10.16,43.18 13.97,46.99 35.56,46.99 37.08,45.47 37.08,32.77 38.1,31.75 40.64,31.75 41.91,33.02 TP29.TP | R15.1 32.64,7.75 32.77,7.62 | TP5.TP 72.64,7.62 32.77,7.62
  pour Top: 50.67,33.02 50.67,37.47 38.1,37.47 38.1,33.02
  pour Top (isolate 0.305): 76.2,16.26 69.34,16.26 69.34,8.89 76.2,8.89
+24V  (via drill 0.35)
  Top 0.305: J2.24V(6) 25.53,33.66 v26.16,33.02
  Top 0.559: v33.78,10.67 TP35.TP 38.35,10.67 TP7.TP | U3.2 45.02,19.94 40.89,15.81 40.89,15.75
  Bottom 0.305: v26.16,33.02 26.16,21.84 24.38,20.07 24.38,18.67 J1.24V(6) 22.86,16.49
  Bottom 0.559: 22.86,16.49 21.53,15.16 21.53,14.03 25.65,9.91 33.02,9.91 v33.78,10.67
  pour Top: 38.1,8.89 43.37,8.89 43.37,16.19 38.1,16.19
DSCLM
  Top 0.305: R19.1 26.16,11.72 26.16,13.21 | 26.16,13.21 R17.2 25.23,13.37 24.07,14.54 24.07,15.11 23.36,15.81 22.03,15.81 21.59,16.26 21.59,17.14 J1.DSCLM(5) 16.76,21.97 16.76,31.37 J2.DSCLM(5) | U2.6 28.34,13.61 27.94,13.21 26.16,13.21
DSCLP
  Top 0.305: R19.2 R16.1 29.32,12.72 28.84,13.21 U2.7 28.84,16.25 28.57,16.51 25.02,16.51 24.38,17.14 24.38,18.16 J1.DSCLP(4)
  Bottom 0.305: J2.DSCLP(4) 25.15,33.91 25.15,21.97 J1.DSCLP(4)
DSDAM  (via drill 0.35)
  Top 0.305: 27.18,17.78 29.08,17.78 29.84,16.76 U2.9 | R14.2 R13.1 arc-90 32.47,17.27 v31.5,17.27 31.37,17.27 | v27.18,18.54 27.18,17.78 | 27.18,17.78 26.92,17.78 26.16,18.54 26.16,19.3 23.24,22.23 J1.DSDAM(2)
  Bottom 0.305: v31.5,17.27 27.18,17.27 v27.18,18.54 | J2.DSDAM(2) 22.86,37.69 21.8,36.63 21.8,30.68 22.86,29.62 J1.DSDAM(2)
DSDAP  (via drill 0.35)
  Top 0.305: R15.2 R14.1 31.26,14.46 v31.24,14.48 | 25.4,18.03 26.29,17.14 28.57,17.14 28.75,17.09 29.34,16.51 U2.8 | 25.4,18.03 25.4,19.05 23.5,20.95 22.23,20.95 21.46,21.72 21.46,22.35 J1.DSDAP(1) 20.32,30.23 21.59,31.5 21.59,38.73 J2.DSDAP(1) | 25.4,18.03 25.14,17.78 v25.14,17.46
  Bottom 0.305: v31.24,14.48 29.21,16.51 25.4,16.51 25.14,16.77 v25.14,17.46
GND  (via drill 0.35)
  Top 0.406: U6.7 108.62,39.28 108.71,39.37 U6.EP | D1.C 52.02,36.21 C6.2
  other vias: 26.92,20.07 31.5,20.07 27.43,14.99 25.15,15.49 48.51,38.61 112.01,41.66 48.01,17.53 40.89,17.53 57.98,18.41 52.13,22.61 41.53,24.19 39.88,20.64 45.4,24.64 73.09,20.07 45.21,13.34 40.64,42.93 38.86,40.64 63.25,33.02 29.97,35.56 99.82,16.51 104.9,46.99 90.68,53.09 45.97,50.29 77.22,3.81 28.45,3.05 103.12,6.6 4.57,17.02 4.57,35.81 66.8,28.7 106.93,21.84 50.29,27.69 66.55,32.77 70.36,42.67 83.82,43.43 94.23,33.02 97.79,33.27 96.77,46.74 69.34,50.29 76.71,50.04 88.39,50.55 62.74,48.01
  pour Top (isolate 0.406): 99.06,33.02 99.06,45.72 114.3,45.72 114.3,33.02
  pour Top (isolate 0.305): 92.71,35.56 92.71,45.72 81.28,45.72 81.28,35.56
  pour Top (isolate 0.305): 80.01,34.29 80.01,45.72 67.31,45.72 67.31,34.29
  pour Top (isolate 0.305): 78.74,8.89 115.57,8.89 115.57,29.21 78.74,29.21
  pour Top (isolate 0.406, rank 3): 60.96,33.02 60.96,45.72 38.1,45.72 38.1,33.02
  pour Top (isolate 0.305, rank 3): 0,0 116.84,0 116.84,54.61 0,54.61
  pour Top (isolate 0.305): 1.27,8.89 35.56,8.89 35.56,45.72 1.27,45.72
  pour Bottom (isolate 0.305): 35.56,8.89 35.56,45.72 1.27,45.72 1.27,8.89
  pour Bottom (isolate 0.305, rank 3): 0,0 116.84,0 116.84,54.61 0,54.61
  pour Top (isolate 0.406, rank 2): 76.2,26.67 38.1,26.67 38.1,8.89 76.2,8.89
  pour Bottom (isolate 0.406, rank 2): 76.2,26.67 38.1,26.67 38.1,8.89 76.2,8.89
  pour Top (isolate 0.305, no thermals): 42.55,18.1 39.81,18.1 39.81,23.18 42.55,23.18
N$4
  Top 0.61: D1.A R2.1
N$5
  Top 0.61: 49.86,42.43 C9.1 | C9.1 49.7,42.43 U4.3 | F2.1 54.85,43.43 51.37,43.43 C9.1
N$20
  Top 0.406: U6.4 U6.5
N$21
  Top 0.406: U6.2 109.82,42.98 C8.1 R18.1
N$31  (via drill 0.35)
  Top 0.559: 49.67,21.21 U3.3 U3.4 | 49.67,21.21 R6.2 | 58.1,23.16 58.1,21.59 57.72,21.21 49.67,21.21
  Top 0.61: R5.1 R6.2
  other vias: 59.18,23.62 68.58,23.81
  pour Top (isolate 0.305): 69.6,20.57 69.6,26.67 56.39,26.67 56.39,20.57
  pour Bottom (isolate 0.305): 69.53,26.67 69.53,20.64 56.52,20.64 56.52,26.67
N$32
  Top 0.559: R7.1 D5.A
N$33  (via drill 0.35)
  Top 0.559: 59.2,11.93 57.91,13.21 | R5.2 52.42,18.27 R7.2 52.44,17.41 53.07,16.78 53.07,15.51 53.34,15.24 | SJ2.1 68.33,13.72
  Top 0.61: SJ2.1 71.1,13.7
  other vias: 58.74,13.97 68.26,11.75
  pour Top: 68.58,8.89 68.58,16.19 52.39,16.19 52.39,8.89
  pour Bottom (isolate 0.305): 68.58,8.89 68.58,16.19 52.39,16.19 52.39,8.89
REG_3V3_400MA
  Top 0.61: SJ3.1 57.17,41.4 | 57.17,41.4 F2.2 | R2.2 52.82,41.93 53.34,41.4 57.17,41.4
SCL  (via drill 0.35)
  Top 0.305: U5.6 76.47,41.64 77.22,40.89 77.22,35.81 TP18.TP v78.23,31.75 | U2.4 28.84,20.69 27.69,21.84 27.69,24.64 28.07,25.02 R21.1 28.96,25.04 28.96,25.91 29.21,26.16 30.99,26.16 32.26,24.89 TP8.TP 40.28,30.38 76.2,30.38 | U7.2 81.03,23.11 TP26.TP 78.99,25.15 78.93,25.15 76.2,27.89 76.2,30.38 | 76.2,30.38 78.23,30.38 | 78.23,30.38 88.39,30.38 | U6.10 110.42,34.36 TP13.TP 108.1,30.38 88.39,30.38 | v78.23,29.46 78.23,30.38 | v88.39,31.75 TP22.TP 88.39,37.08 87.55,37.93 U8.6 | v88.39,29.72 88.39,30.38
  Bottom 0.305: v78.23,31.75 v78.23,29.46 | v88.39,31.75 v88.39,29.72
SDA  (via drill 0.35)
  Top 0.305: U5.1 71.9,41.64 71.63,41.91 71.63,42.67 71.88,42.93 76.45,42.93 77.98,41.4 77.98,36.32 TP17.TP 79.25,30.99 | U2.2 29.84,20.71 28.94,21.61 R20.1 28.94,23.61 v28.96,23.62 | v28.96,26.92 29.11,26.77 31.24,26.77 32.36,25.65 34.29,25.65 TP9.TP 39.62,30.99 76.96,30.99 | U6.9 109.82,33.69 TP14.TP 107.44,30.99 89.41,30.99 | 89.41,30.99 79.25,30.99 | 79.25,30.99 76.96,30.99 | U7.1 79.5,25.65 TP25.TP 76.96,28.19 v76.96,29.46 | U8.1 90.25,37.67 89.41,36.83 TP21.TP 89.41,30.99 | v76.96,31.75 76.96,30.99
  Top 0.406: 72.5,41.66 U5.1
  Bottom 0.305: v28.96,23.62 v28.96,26.92 | v76.96,29.46 v76.96,31.75
USBM  (via drill 0.35)
  Top 0.305: v26.92,29.72 25.53,31.11 J2.USBM(8)
  Bottom 0.305: v26.92,29.72 26.92,21.59 25.15,19.81 25.15,18.54 24.38,17.77 24.38,16.13 J1.USBM(8)
USBP  (via drill 0.35)
  Top 0.305: v17.53,29.72 20.19,32.38 J2.USBP(7)
  Bottom 0.305: v17.53,29.72 17.53,18.67 J1.USBP(7)

### Text on the board
tPlace: Air Sensor Node v1.0 | GND | GND | GND | GND | GND | Fuse | 0x40 | I2C Addr | 0x40 | 3V3 | SCL | SDA | Enable | I2C Addr | SDA | 0x5A | 3V3 | SCL | I2C Addr | 5V | 3.3V | HTU20DF Temp/Hum | 3V3 | SDA | SCL | SHT25 Temp/Hum Sensor | CCS811 CO2 Sensor | 5-26V to 3.3V@400mA Regulator / w/3v3 Enable, Indicator LED & Fuse | SDA | SDA | EDGE | GND | NC | SCL | GND | SCL | 3V3 | 3V3 | 5V | Enable | 0x15 | 24V | I2C Addr | GND | 24V | GND | NC | GND | RJ45 Connector w/dI2C Buffer | 5V | 24V-to-5V@1A Switching Regulator w/Indicator LED + Enable | T6713 CO2 Sensor